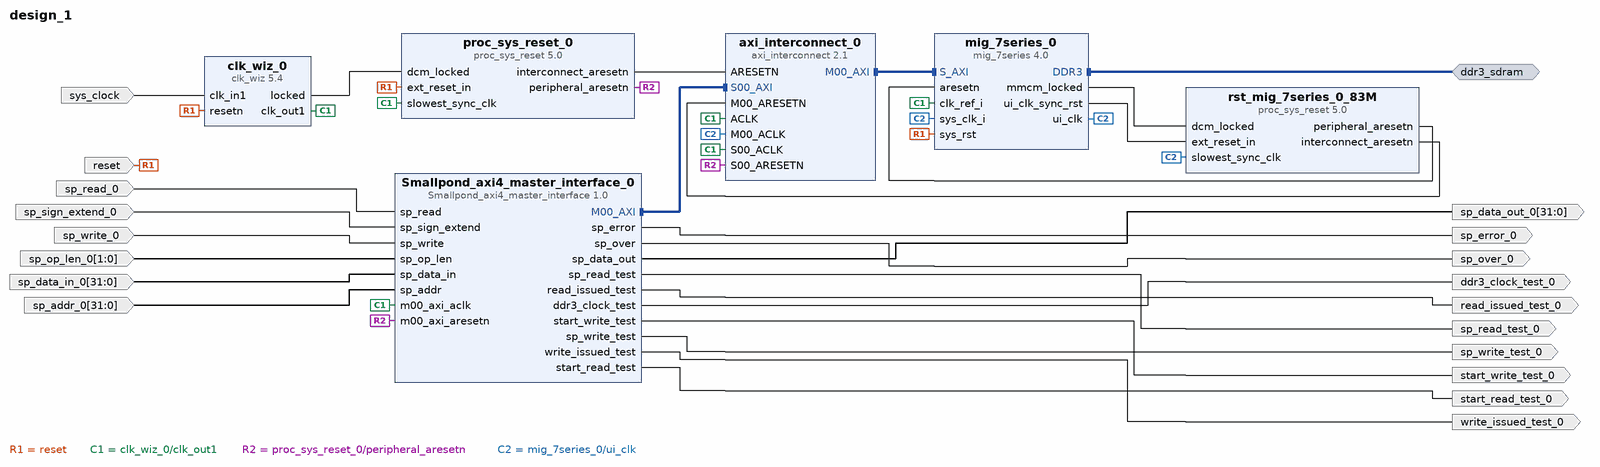
[diagram p0: block diagram of the top level]
# Vivado block design design_1, xc7a35ticsg324-1L, Vivado 2017.3.1
create_bd_design design_1

create_bd_intf_port -mode Master -vlnv xilinx.com:interface:ddrx_rtl:1.0 ddr3_sdram
create_bd_port -dir I -type rst reset
set_property -dict {CONFIG.POLARITY ACTIVE_LOW} [get_bd_ports reset]
create_bd_port -dir I -type clk sys_clock
set_property -dict {CONFIG.FREQ_HZ 100000000 CONFIG.PHASE 0.000} [get_bd_ports sys_clock]
create_bd_port -dir I sp_read_0
create_bd_port -dir I sp_sign_extend_0
create_bd_port -dir I sp_write_0
create_bd_port -dir I -from 1 -to 0 sp_op_len_0
create_bd_port -dir O sp_error_0
create_bd_port -dir O sp_over_0
create_bd_port -dir I -from 31 -to 0 sp_data_in_0
create_bd_port -dir I -from 31 -to 0 sp_addr_0
create_bd_port -dir O -from 31 -to 0 sp_data_out_0
create_bd_port -dir O sp_read_test_0
create_bd_port -dir O write_issued_test_0
create_bd_port -dir O start_write_test_0
create_bd_port -dir O sp_write_test_0
create_bd_port -dir O read_issued_test_0
create_bd_port -dir O start_read_test_0
create_bd_port -dir O ddr3_clock_test_0

create_bd_cell -type ip -vlnv xilinx.com:ip:mig_7series:4.0 mig_7series_0
set_property -dict [list \
  CONFIG.XML_INPUT_FILE mig_a.prj \
  CONFIG.RESET_BOARD_INTERFACE reset \
  CONFIG.MIG_DONT_TOUCH_PARAM Custom \
  CONFIG.BOARD_MIG_PARAM ddr3_sdram \
] [get_bd_cells mig_7series_0]
create_bd_cell -type ip -vlnv xilinx.com:ip:axi_interconnect:2.1 axi_interconnect_0
set_property -dict {CONFIG.NUM_MI 1} [get_bd_cells axi_interconnect_0]
create_bd_cell -type ip -vlnv xilinx.com:ip:proc_sys_reset:5.0 proc_sys_reset_0
set_property -dict {CONFIG.USE_BOARD_FLOW true CONFIG.RESET_BOARD_INTERFACE reset} [get_bd_cells proc_sys_reset_0]
create_bd_cell -type ip -vlnv xilinx.com:ip:clk_wiz:5.4 clk_wiz_0
set_property -dict [list \
  CONFIG.RESET_PORT resetn \
  CONFIG.RESET_TYPE ACTIVE_LOW \
  CONFIG.USE_BOARD_FLOW true \
  CONFIG.CLK_IN1_BOARD_INTERFACE sys_clock \
] [get_bd_cells clk_wiz_0]
create_bd_cell -type ip -vlnv xilinx.com:ip:proc_sys_reset:5.0 rst_mig_7series_0_83M
set_property -dict {CONFIG.USE_BOARD_FLOW true CONFIG.RESET_BOARD_INTERFACE reset} [get_bd_cells rst_mig_7series_0_83M]
create_bd_cell -type ip -vlnv user.org:user:Smallpond_axi4_master_interface:1.0 Smallpond_axi4_master_interface_0

# ---- connections ----

connect_bd_intf_net [get_bd_intf_pins axi_interconnect_0/M00_AXI] [get_bd_intf_pins mig_7series_0/S_AXI]
connect_bd_intf_net [get_bd_intf_pins axi_interconnect_0/S00_AXI] [get_bd_intf_pins Smallpond_axi4_master_interface_0/M00_AXI]
connect_bd_intf_net [get_bd_intf_ports ddr3_sdram] [get_bd_intf_pins mig_7series_0/DDR3]
connect_bd_net [get_bd_ports reset] [get_bd_pins proc_sys_reset_0/ext_reset_in] [get_bd_pins clk_wiz_0/resetn] [get_bd_pins mig_7series_0/sys_rst]
connect_bd_net [get_bd_ports sys_clock] [get_bd_pins clk_wiz_0/clk_in1]
connect_bd_net [get_bd_pins clk_wiz_0/clk_out1] \
  [get_bd_pins proc_sys_reset_0/slowest_sync_clk] [get_bd_pins mig_7series_0/clk_ref_i] \
  [get_bd_pins axi_interconnect_0/S00_ACLK] [get_bd_pins axi_interconnect_0/ACLK] \
  [get_bd_pins Smallpond_axi4_master_interface_0/m00_axi_aclk]
connect_bd_net [get_bd_pins clk_wiz_0/locked] [get_bd_pins proc_sys_reset_0/dcm_locked]
connect_bd_net [get_bd_pins proc_sys_reset_0/interconnect_aresetn] [get_bd_pins axi_interconnect_0/ARESETN]
connect_bd_net [get_bd_pins proc_sys_reset_0/peripheral_aresetn] \
  [get_bd_pins axi_interconnect_0/S00_ARESETN] [get_bd_pins Smallpond_axi4_master_interface_0/m00_axi_aresetn]
connect_bd_net [get_bd_pins mig_7series_0/ui_clk] \
  [get_bd_pins mig_7series_0/sys_clk_i] [get_bd_pins rst_mig_7series_0_83M/slowest_sync_clk] \
  [get_bd_pins axi_interconnect_0/M00_ACLK]
connect_bd_net -net sp_read_0_1 [get_bd_ports sp_read_0] [get_bd_pins Smallpond_axi4_master_interface_0/sp_read]
connect_bd_net -net sp_sign_extend_0_1 [get_bd_ports sp_sign_extend_0] [get_bd_pins Smallpond_axi4_master_interface_0/sp_sign_extend]
connect_bd_net -net sp_write_0_1 [get_bd_ports sp_write_0] [get_bd_pins Smallpond_axi4_master_interface_0/sp_write]
connect_bd_net -net sp_op_len_0_1 [get_bd_ports sp_op_len_0] [get_bd_pins Smallpond_axi4_master_interface_0/sp_op_len]
connect_bd_net [get_bd_pins Smallpond_axi4_master_interface_0/sp_error] [get_bd_ports sp_error_0]
connect_bd_net [get_bd_pins Smallpond_axi4_master_interface_0/sp_over] [get_bd_ports sp_over_0]
connect_bd_net -net sp_data_in_0_1 [get_bd_ports sp_data_in_0] [get_bd_pins Smallpond_axi4_master_interface_0/sp_data_in]
connect_bd_net -net sp_addr_0_1 [get_bd_ports sp_addr_0] [get_bd_pins Smallpond_axi4_master_interface_0/sp_addr]
connect_bd_net [get_bd_pins Smallpond_axi4_master_interface_0/sp_data_out] [get_bd_ports sp_data_out_0]
connect_bd_net -net proc_sys_reset_1_peripheral_aresetn [get_bd_pins rst_mig_7series_0_83M/peripheral_aresetn] [get_bd_pins mig_7series_0/aresetn]
connect_bd_net -net M00_ARESETN_1 [get_bd_pins rst_mig_7series_0_83M/interconnect_aresetn] [get_bd_pins axi_interconnect_0/M00_ARESETN]
connect_bd_net [get_bd_pins mig_7series_0/mmcm_locked] [get_bd_pins rst_mig_7series_0_83M/dcm_locked]
connect_bd_net [get_bd_pins mig_7series_0/ui_clk_sync_rst] [get_bd_pins rst_mig_7series_0_83M/ext_reset_in]
connect_bd_net [get_bd_pins Smallpond_axi4_master_interface_0/sp_read_test] [get_bd_ports sp_read_test_0]
connect_bd_net [get_bd_pins Smallpond_axi4_master_interface_0/write_issued_test] [get_bd_ports write_issued_test_0]
connect_bd_net [get_bd_pins Smallpond_axi4_master_interface_0/start_write_test] [get_bd_ports start_write_test_0]
connect_bd_net [get_bd_pins Smallpond_axi4_master_interface_0/sp_write_test] [get_bd_ports sp_write_test_0]
connect_bd_net [get_bd_pins Smallpond_axi4_master_interface_0/read_issued_test] [get_bd_ports read_issued_test_0]
connect_bd_net [get_bd_pins Smallpond_axi4_master_interface_0/start_read_test] [get_bd_ports start_read_test_0]
connect_bd_net [get_bd_pins Smallpond_axi4_master_interface_0/ddr3_clock_test] [get_bd_ports ddr3_clock_test_0]

# ---- address map ----
assign_bd_address -offset 0x80000000 -range 256M -target_address_space [get_bd_addr_spaces Smallpond_axi4_master_interface_0/M00_AXI] [get_bd_addr_segs mig_7series_0/memmap/memaddr]

validate_bd_design
save_bd_design
